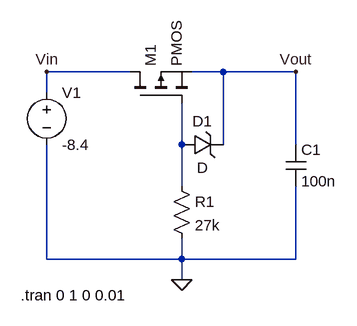
[diagram p0: schematic Rpp.asc]
Rpp.asc, the LTspice schematic file:
Version 4.1
SHEET 1 880 680
WIRE 192 64 64 64
WIRE 336 64 288 64
WIRE 448 64 336 64
WIRE 64 96 64 64
WIRE 272 176 272 112
WIRE 336 176 336 64
WIRE 448 176 448 64
WIRE 272 240 272 176
WIRE 64 352 64 176
WIRE 272 352 272 320
WIRE 272 352 64 352
WIRE 448 352 448 240
WIRE 448 352 272 352
WIRE 272 384 272 352
FLAG 272 384 0
FLAG 448 64 Vout
FLAG 64 64 Vin
SYMBOL voltage 64 80 R0
WINDOW 123 0 0 Left 0
WINDOW 39 0 0 Left 0
SYMATTR InstName V1
SYMATTR Value -8.4
SYMBOL pmos 192 112 R270
SYMATTR InstName M1
SYMBOL zener 272 192 R270
WINDOW 0 36 32 VTop 2
WINDOW 3 -4 32 VBottom 2
SYMATTR InstName D1
SYMBOL res 256 224 R0
SYMATTR InstName R1
SYMATTR Value 27k
SYMBOL cap 432 176 R0
SYMATTR InstName C1
SYMATTR Value 100n
TEXT 24 408 Left 2 !.tran 0 1 0 0.01

The netlist it stands for:
* Rpp.asc
V1 Vin 0 -8.4
M1 Vin N001 Vout Vout PMOS
D1 N001 Vout D
R1 N001 0 27k
C1 Vout 0 100n
.model D D
.lib standard.dio
.model NMOS NMOS
.model PMOS PMOS
.lib standard.mos
.tran 0 1 0 0.01
.backanno
.end

* Results of the author's LTspice run, read from the files saved beside the schematic
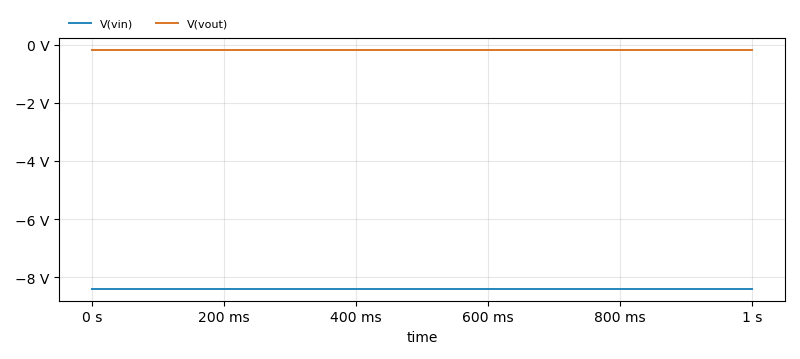
[diagram p1: Transient Analysis of Rpp.asc, plotted from the saved traces]
* Transient Analysis, 1 run:
*   V(vin): min -8.4 V, max -8.4 V, average -8.4 V, rms 8.4 V, last -8.4 V
*   V(vout): min -191.2 mV, max -191.2 mV, average -191.2 mV, rms 191.2 mV, last -191.2 mV